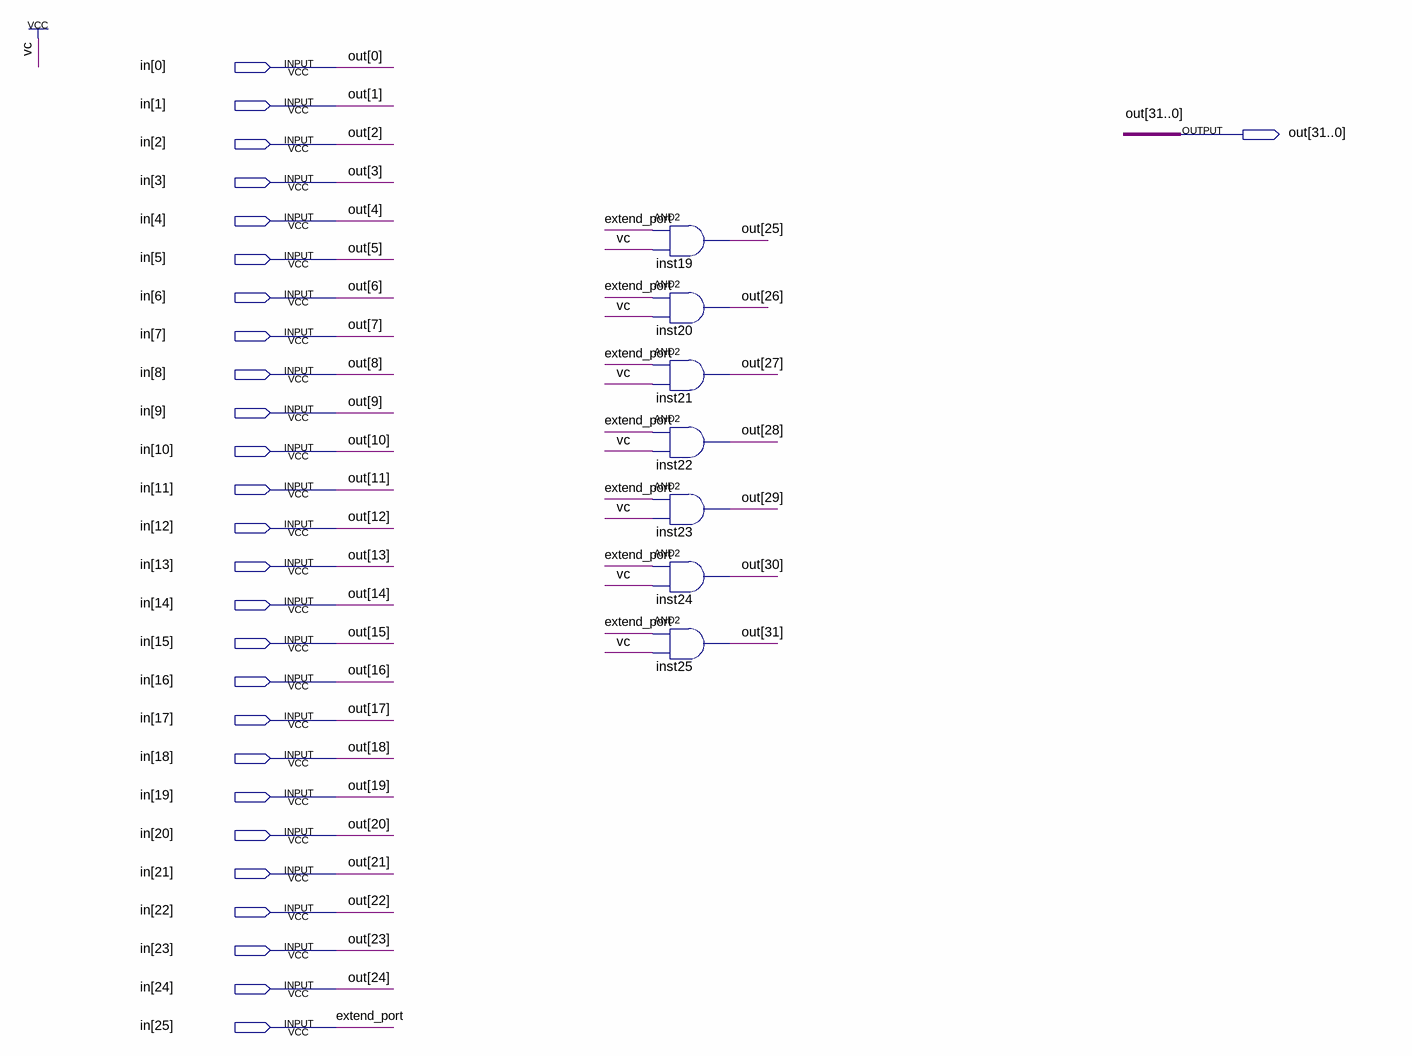
[diagram p0: schematic sheet]
// Quartus schematic 26extend32_signed.bdf as structural Verilog: 7 symbols, 27 pins
module \26extend32_signed  (
  input  [25:0] in,
  output [31:0] out
);

  and inst19 (out[25], in[25], 1'b1);
  and inst20 (out[26], in[25], 1'b1);
  and inst21 (out[27], in[25], 1'b1);
  and inst22 (out[28], in[25], 1'b1);
  and inst23 (out[29], in[25], 1'b1);
  and inst24 (out[30], in[25], 1'b1);
  and inst25 (out[31], in[25], 1'b1);

  assign out[24:0] = in[24:0];

  // Other names for the same wires on the sheet: extend_port = in[25]
endmodule
